# EAGLE design sensornode (EAGLE 7.7.0)
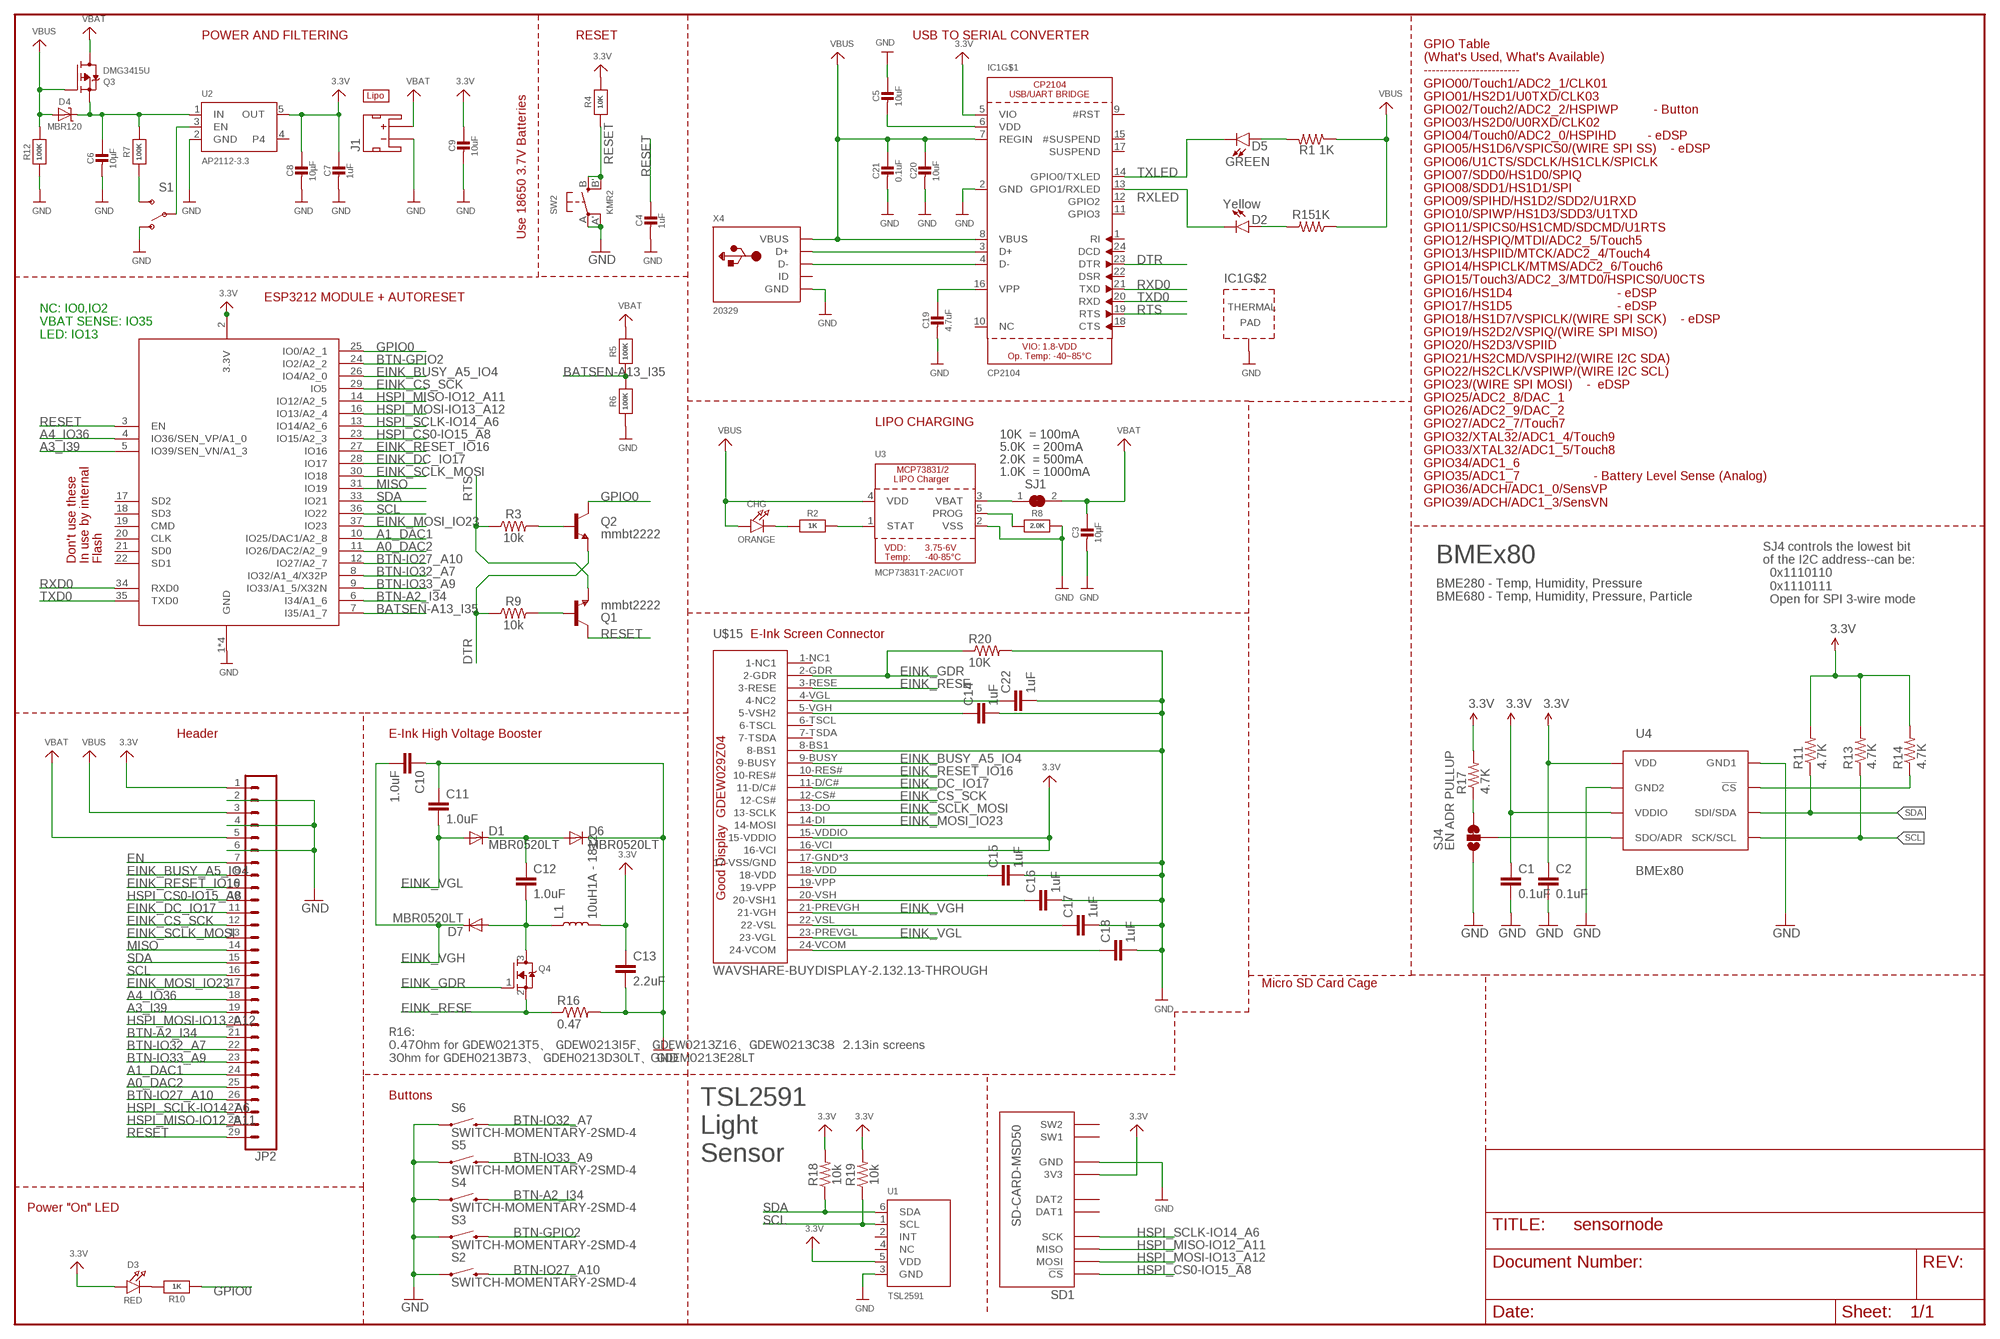
[diagram p0: schematic, sheet 1]

## Parts
BT1  LIPO-OUTLINE2000  [LIPO-2000]
C1  0.1uF  0.1UF-25V-5%(0603)  [0603-CAP]
C2  0.1uF  0.1UF-25V-5%(0603)  [0603-CAP]
C3  10µF  CAP_CERAMIC0805-NOOUTLINE  [0805-NO]
C4  1uF  CAP_CERAMIC0603_NO  [0603-NO]
C5  10uF  CAP_CERAMIC0805-NOOUTLINE  [0805-NO]
C6  10µF  CAP_CERAMIC0805-NOOUTLINE  [0805-NO]
C7  1uF  CAP_CERAMIC0603_NO  [0603-NO]
C8  10µF  CAP_CERAMIC0805-NOOUTLINE  [0805-NO]
C9  10uF  CAP_CERAMIC0805-NOOUTLINE  [0805-NO]
C10  1.0uF  1.0UF-0603-16V-10%  [0603]
C11  1.0uF  1.0UF-0603-16V-10%  [0603]
C12  1.0uF  1.0UF-0603-16V-10%  [0603]
C13  2.2uF  2.2UF-0603-10V-20%  [0603]
C14  1uF  0.1UF-25V-5%(0603)  [0603-CAP]
C15  1uF  0.1UF-25V-5%(0603)  [0603-CAP]
C16  1uF  0.1UF-25V-5%(0603)  [0603-CAP]
C17  1uF  0.1UF-25V-5%(0603)  [0603-CAP]
C18  1uF  0.1UF-25V-5%(0603)  [0603-CAP]
C19  4.7uF  CAP_CERAMIC0805-NOOUTLINE  [0805-NO]
C20  10uF  CAP_CERAMIC0805-NOOUTLINE  [0805-NO]
C21  0.1uF  CAP_CERAMIC0805-NOOUTLINE  [0805-NO]
C22  1uF  0.1UF-25V-5%(0603)  [0603-CAP]
CHG  ORANGE  LED0805_NOOUTLINE  [CHIPLED_0805_NOOUTLINE]
D1  MBR0520LT  [SOD123]
D2  Yellow  LED-YELLOW0603  [LED-0603]
D3  RED  LED0805_NOOUTLINE  [CHIPLED_0805_NOOUTLINE]
D4  MBR120  DIODE-SCHOTTKYSOD-123  [SOD-123]
D5  GREEN  LED-GREEN0603  [LED-0603]
D6  MBR0520LT  [SOD123]
D7  MBR0520LT  [SOD123]
IC1  CP2104  [QFN24_4MM_SMSC]
J1  JST_2MM_MALE  [JST-2-SMD]
JP2  CONN_29  [1X29]
L1  10uH1A - 1812  INDUCTOR  [1815]
Q1  mmbt2222  TRANSISTOR_NPNSOT23-3  [SOT23-3]
Q2  mmbt2222  TRANSISTOR_NPNSOT23-3  [SOT23-3]
Q3  DMG3415U  MOSFET-P  [SOT23-R]
Q4  MOSFET-NREFLOW  [SOT23]
R1  1K  1KOHM-1/10W-1%(0603)  [0603-RES]
R2  1K  RESISTOR_0603_NOOUT  [0603-NO]
R3  10k  10KOHM-0603-1/10W-1%  [0603]
R4  10K  RESISTOR_0603_NOOUT  [0603-NO]
R5  100K  RESISTOR_0603_NOOUT  [0603-NO]
R6  100K  RESISTOR_0603_NOOUT  [0603-NO]
R7  100K  RESISTOR_0603_NOOUT  [0603-NO]
R8  2.0K  RESISTOR_0603_NOOUT  [0603-NO]
R9  10k  10KOHM-0603-1/10W-1%  [0603]
R10  1K  RESISTOR_0603_NOOUT  [0603-NO]
R11  4.7K  4.7KOHM-1/10W-1%(0603)  [0603-RES]
R12  100K  RESISTOR_0603_NOOUT  [0603-NO]
R13  4.7K  4.7KOHM-1/10W-1%(0603)  [0603-RES]
R14  4.7K  4.7KOHM-1/10W-1%(0603)  [0603-RES]
R15  1K  1KOHM-1/10W-1%(0603)  [0603-RES]
R16  0.47  4.7KOHM-1/10W-1%(0603)  [0603-RES]
R17  4.7K  4.7KOHM-1/10W-1%(0603)  [0603-RES]
R18  10k  10KOHM-0603-1/10W-1%  [0603]
R19  10k  10KOHM-0603-1/10W-1%  [0603]
R20  10K  4.7KOHM-1/10W-1%(0603)  [0603-RES]
S1  SWITCH-SPDT-SMD-A  [SWITCH-SPST-SMD-A]
S2  SWITCH-MOMENTARY-2SMD-4  [TACTILE_SWITCH_TALL]
S3  SWITCH-MOMENTARY-2SMD-4  [TACTILE_SWITCH_TALL]
S4  SWITCH-MOMENTARY-2SMD-4  [TACTILE_SWITCH_TALL]
S5  SWITCH-MOMENTARY-2SMD-4  [TACTILE_SWITCH_TALL]
S6  SWITCH-MOMENTARY-2SMD-4  [TACTILE_SWITCH_TALL]
SD1  SD-CARD-MSD50  [SD_5031821853]
SJ1  SOLDERJUMPER_CLOSED  [SOLDERJUMPER_CLOSEDWIRE@1]
SJ4  EN ADR PULLUP  JUMPER-PAD-3-2OF3_NC_BY_TRACE_SMALL  [PAD-JUMPER-3-2OF3_NC_BY_TRACE_YES_SILK_FULL_BOX]
SW2  KMR2  SWITCH_TACT_SMT4.6X2.8  [BTN_KMR2_4.6X2.8]
U1  TSL2591  LIGHT_TSL2591  [DFN6_TAOS]
U2  AP2112-3.3  VREG_SOT23-5  [SOT23-5]
U3  MCP73831T-2ACI/OT  MCP73831/2  [SOT23-5]
U4  BMEx80  BME280  [BME280_LGA]
U$15  WAVSHARE-BUYDISPLAY-2.132.13-THROUGH  [WAVSHARE-BUYDISPLAY-2.13-THM]
X2  ESP32_WROOM32_SKINNY  [WROOM32_SKINNY]
X4  20329  MICRO-USB-SMD-B-(10118193-0001LF)-ADASYM  [MICRO-USB5+6P-SMD-0.65-B]

## Nets
3.3V: C1.1 C2.1 C7.1 C8.1 C9.1 C13.1 D3.A IC1.5(VIO) JP2.1 L1.2 R1.1 R4.2 R11.2 R13.2 R14.2 R15.1 R17.2 R18.2 R19.2 SD1.VCC(3V3) U1.5(VDD) U2.5(OUT) U4.P$6(VDDIO) U4.P$8(VDD) U$15.15-VDDIO U$15.16-VCI X2.2(3.3V) ; supply symbol labelled VBUS
!CS: R14.1 U4.P$2(!CS)
A0_DAC2: JP2.25 X2.11(IO26/DAC2/A2_9)
A1_DAC1: JP2.24 X2.10(IO25/DAC1/A2_8)
A3_I39: JP2.19 X2.5(IO39/SEN_VN/A1_3)
A4_IO36: JP2.18 X2.4(IO36/SEN_VP/A1_0)
BATSEN-A13_I35: R5.1 R6.2 X2.7(I35/A1_7)
BTN-A2_I34: JP2.21 S4.B2 X2.6(I34/A1_6)
BTN-GPIO2: S3.B2 X2.24(IO2/A2_2)
BTN-IO27_A10: JP2.26 S2.B2 X2.12(IO27/A2_7)
BTN-IO32_A7: JP2.22 S6.B2 X2.8(IO32/A1_4/X32P)
BTN-IO33_A9: JP2.23 S5.B2 X2.9(IO33/A1_5/X32N)
DTR: IC1.23(DTR) Q2.2(E) R9.1
EINK_BUSY_A5_IO4: JP2.8 U$15.9-BUSY X2.26(IO4/A2_0)
EINK_CS_SCK: JP2.12 U$15.12-CS# X2.29(IO5)
EINK_DC_IO17: JP2.11 U$15.11-D/C# X2.28(IO17)
EINK_GDR: Q4.1(G) R20.1 U$15.2-GDR
EINK_MOSI_IO23: JP2.17 U$15.14-DI(14-MOSI) X2.37(IO23)
EINK_RESE: Q4.2(S) R16.1 U$15.3-RESE
EINK_RESET_IO16: JP2.9 U$15.10-RES# X2.27(IO16)
EINK_SCLK_MOSI: JP2.13 U$15.13-DO(13-SCLK) X2.30(IO18)
EINK_VGH: C10.2 D7.C U$15.21-PREVGH(21-VGH)
EINK_VGL: C11.2 D1.A U$15.23-PREVGL(23-VGL)
EN: JP2.7 S1.2(P) U2.3(EN)
GND: C1.2 C2.2 C3.2 C4.2 C5.1 C6.2 C7.2 C8.2 C9.2 C10.1 C11.1 C13.2 C14.2 C15.2 C16.2 C17.2 C18.2 C19.2 C20.2 C21.2 C22.2 D6.C IC1.2(GND) IC1.THERM(TP) J1.1(-) JP2.2 JP2.4 JP2.6 R6.1 R8.2 R12.1 R16.2 R20.2 S1.1(O) S2.A2 S3.A2 S4.A2 S5.A2 S6.A2 SD1.GND SJ4.1 SW2.A'(P1) SW2.A(P) U1.3(GND) U2.2(GND) U3.2(VSS) U4.P$1(GND1) U4.P$7(GND2) U$15.8-BS1 U$15.17-GND(17-VSS/GND) U$15.25(17-VSS/GND) U$15.26(17-VSS/GND) X2.1(GND) X2.15(GND) X2.38(GND) X2.P$1(GND) X4.5(GND) X4.S1(GND) X4.S2(GND) X4.S3(GND) X4.S4(GND) X4.S5(GND) X4.S6(GND)
GPIO0: Q2.3(C) R10.1 X2.25(IO0/A2_1)
HSPI_CS0-IO15_A8: JP2.10 SD1.CS(!CS) X2.23(IO15/A2_3)
HSPI_MISO-IO12_A11: JP2.28 SD1.MISO X2.14(IO12/A2_5)
HSPI_MOSI-IO13_A12: JP2.20 SD1.MOSI X2.16(IO13/A2_4)
HSPI_SCLK-IO14_A6: JP2.27 SD1.SCK X2.13(IO14/A2_6)
MISO: JP2.14 X2.31(IO19)
N$1: CHG.C R2.1
N$2: R8.1 U3.5(PROG)
N$3: R2.2 U3.1(STAT)
N$4: R7.1 S1.3(S)
N$5: D3.C R10.2
N$6: C5.2 IC1.6(VDD)
N$7: C6.1 D4.C Q3.2(S) R7.2 U2.1(IN)
N$8: D5.A R1.2
N$9: SJ1.1 U3.3(VBAT)
N$10: D2.A R15.2
N$11: C12.1 D1.C D6.A
N$12: Q1.1(B) R9.2
N$13: Q2.1(B) R3.2
N$14: C12.2 D7.A L1.1 Q4.3(D)
N$15: R17.1 SJ4.3
N$16: C15.1 U$15.18-VDD
N$17: C16.1 U$15.20-VSH(20-VSH1)
N$18: C17.1 U$15.22-VSL
N$19: C18.1 U$15.24-VCOM
N$20: C14.1 U$15.5-VGH(5-VSH2)
N$23: C19.1 IC1.16(VPP)
N$24: C22.1 U$15.4-VGL(4-NC2)
RESET: C4.1 JP2.29 Q1.3(C) R4.1 SW2.B'(S1) SW2.B(S) X2.3(EN)
RTS: IC1.19(RTS) Q1.2(E) R3.1
RXD0: IC1.21(TXD) X2.34(RXD0)
RXLED: D2.C IC1.13(GPIO1/RXLED)
SCL: JP2.16 R13.1 R19.1 U1.1(SCL) U4.P$4(SCK/SCL) X2.36(IO22)
SDA: JP2.15 R11.1 R18.1 U1.6(SDA) U4.P$3(SDI/SDA) X2.33(IO21)
SDO/ADR: SJ4.2 U4.P$5(SDO/ADR)
TXD0: IC1.20(RXD) X2.35(TXD0)
TXLED: D5.C IC1.14(GPIO0/TXLED)
USBD_N [USB1]: IC1.4(D-) X4.2(D-)
USBD_P [USB1]: IC1.3(D+) X4.3(D+)
VBAT: C3.1 J1.2(+) JP2.5 Q3.3(D) R5.2 SJ1.2
VBUS: C20.1 C21.1 CHG.A D4.A IC1.7(REGIN) IC1.8(VBUS) JP2.3 Q3.1(G) R12.2 U3.4(VDD) X4.1(VBUS)
Unconnected: IC1.1(RI) IC1.9(#RST) IC1.10(NC) IC1.11(GPIO3) IC1.12(GPIO2) IC1.15(#SUSPEND) IC1.17(SUSPEND) IC1.18(CTS) IC1.22(DSR) IC1.24(DCD) J1.NC1(PAD1) J1.NC2(PAD2) SD1.DAT1 SD1.DAT2 SD1.SW1 SD1.SW2 U1.2(INT) U1.4(NC) U2.4 U$15.1-NC1 U$15.6-TSCL U$15.7-TSDA U$15.19-VPP X2.17(SD2) X2.18(SD3) X2.19(CMD) X2.20(CLK) X2.21(SD0) X2.22(SD1) X4.4(ID)

## Notes on the sheet
- POWER AND FILTERING | RESET | USB TO SERIAL CONVERTER
- GPIO Table
  (What's Used, What's Available)
  ------------------------
  GPIO00/Touch1/ADC2_1/CLK01
  GPIO01/HS2D1/U0TXD/CLK03
  GPIO02/Touch2/ADC2_2/HSPIWP          - Button
  GPIO03/HS2D0/U0RXD/CLK02
  GPIO04/Touch0/ADC2_0/HSPIHD         - eDSP
  GPIO05/HS1D6/VSPICS0/(WIRE SPI SS)    - eDSP
  GPIO06/U1CTS/SDCLK/HS1CLK/SPICLK
  GPIO07/SDD0/HS1D0/SPIQ
  GPIO08/SDD1/HS1D1/SPI
  GPIO09/SPIHD/HS1D2/SDD2/U1RXD
  GPIO10/SPIWP/HS1D3/SDD3/U1TXD
  GPIO11/SPICS0/HS1CMD/SDCMD/U1RTS
  GPIO12/HSPIQ/MTDI/ADC2_5/Touch5
  GPIO13/HSPIID/MTCK/ADC2_4/Touch4
  GPIO14/HSPICLK/MTMS/ADC2_6/Touch6
  GPIO15/Touch3/ADC2_3/MTD0/HSPICS0/U0CTS
  GPIO16/HS1D4                              - eDSP
  GPIO17/HS1D5                              - eDSP
  GPIO18/HS1D7/VSPICLK/(WIRE SPI SCK)    - eDSP
  GPIO19/HS2D2/VSPIQ/(WIRE SPI MISO)
  GPIO20/HS2D3/VSPIID
  GPIO21/HS2CMD/VSPIH2/(WIRE I2C SDA)
  GPIO22/HS2CLK/VSPIWP/(WIRE I2C SCL)
  GPIO23/(WIRE SPI MOSI)    -  eDSP
  GPIO25/ADC2_8/DAC_1
  GPIO26/ADC2_9/DAC_2
  GPIO27/ADC2_7/Touch7
  GPIO32/XTAL32/ADC1_4/Touch9
  GPIO33/XTAL32/ADC1_5/Touch8
  GPIO34/ADC1_6
  GPIO35/ADC1_7                     - Battery Level Sense (Analog)
  GPIO36/ADCH/ADC1_0/SensVP
  GPIO39/ADCH/ADC1_3/SensVN
- Use 18650 3.7V Batteries
- ESP3212 MODULE + AUTORESET
- NC: IO0,IO2
  VBAT SENSE: IO35
  LED: IO13
- LIPO CHARGING
- 10K  = 100mA
- 5.0K  = 200mA
- 2.0K  = 500mA
- 1.0K  = 1000mA
- SJ4 controls the lowest bit
  of the I2C address--can be:
    0x1110110
    0x1110111
    Open for SPI 3-wire mode
- Don't use these
  In use by internal
  Flash
- BMEx80
- BME280 - Temp, Humidity, Pressure
  BME680 - Temp, Humidity, Pressure, Particle
- E-Ink Screen Connector
- Header | E-Ink High Voltage Booster
- Micro SD Card Cage
- R16:
  0.47Ohm for GDEW0213T5、 GDEW0213I5F、 GDEW0213Z16、GDEW0213C38  2.13in screens
  3Ohm for GDEH0213B73、 GDEH0213D30LT、 GDEM0213E28LT
- TSL2591
  Light
  Sensor
- Buttons
- Power "On" LED

## Library data of the parts
BT1 = SparkFun-Batteries:LIPO-OUTLINE: LiPo Battery Outlines Outlines for common LiPo batteries sold by SparkFun. (Note: no terminals or connection points, just the dimensions.) SparkFun Products Polymer Lithium Ion Battery - 110mAh <https://www.sparkfun.com/products/13853> (PRT-13853) Polymer Lithium Ion Battery - 1000mAh <https://www.sparkfun.com/products/13813> (PRT-13813) Polymer Lithium Ion Battery - 2000mAh <https://www.sparkfun.com/products/8483> (PRT-08483); PROD_ID: BATT-08764; SF_SKU: PRT-08483
C1 C2 = SparkFun-Capacitors:0.1UF-25V-5%(0603): CAP-08604; PROD_ID: CAP-08604
C3-C9 C19-C21 = microbuilder:CAP_CERAMIC: Ceramic Capacitors For new designs, use the packages preceded by an '_' character since they are more reliable: The following footprints should be used on most boards: _0402 - Standard footprint for regular board layouts _0603 - Standard footprint for regular board layouts _0805 - Standard footprint for regular board layouts _1206 - Standard footprint for regular board layouts For extremely tight-pitch boards where space is at a premium, the following 'micro-pitch' footprints can be used (smaller pads, no silkscreen outline, etc.): _0402MP - Micro-pitch footprint for very dense/compact boards _0603MP - Micro-pitch footprint for very dense/compact boards _0805MP - Micro-pitch footprint for very dense/compact boards _1206MP - Micro-pitch footprint for very dense/compact boards
C10-C12 = SparkFun-Capacitors:1.0UF: 1µF ceramic capacitors A capacitor is a passive two-terminal electrical component used to store electrical energy temporarily in an electric field.; PROD_ID: CAP-00868
C13 = SparkFun-Capacitors:2.2UF: 2.2µF ceramic capacitors A capacitor is a passive two-terminal electrical component used to store electrical energy temporarily in an electric field.; PROD_ID: CAP-07888
C14-C18 C22 = SparkFun-Capacitors:0.1UF-25V-5%(0603): CAP-08604; PROD_ID: CAP-08604; VALUE: 0.1uF
CHG D3 = microbuilder:LED: LED 0603 - 0603 Surface Mount Package 2mA: Green LED - Low Power (3.9mcd, 2ma, 1.7Vf) - Digikey: 475-2709-2-ND Orange LED - Low Power (9.8mcd, 2ma, 1.8Vf) - Digikey: 475-1194-2-ND Red LED - Low Power (5mcd, 2ma, 1.8Vf) - Digikey: 475-1195-2-ND Yellow LED - Low Power (7mcd, 2ma, 1.8Vf) - Digikey: 475-1196-2-ND 5mA: Blue LED - Low Power (17mcd, 5ma, 2.9Vf) - Digikey: LNJ937W8CRACT-ND 0805 - 0805 Surface Mount Package 2mA: Red LED (8.8mcd, 2mA, 1.8Vf, Clear) - Low Power [Digikey: 475-2510-1-ND] Green LED (5mcd, 2mA, 1.8Vf, Clear) - Low Power [Digikey: 475-2730-1-ND] Yellow LED (11.3mcd, 2mA, 1.8Vf, Clear) - Low Power [Digikey: 475-2555-1-ND] 20mA: Red LED (104mcd, 20mA, Diffused) - LS R976 [Digikey: 475-1278-6-ND] Red LED (12mcd, 20mA, 2.0Vf, Clear) - APT2012EC [Digikey: 754-1128-1-ND] Green LED (15mcd, 20mA, 2.2Vf, Clear) - APT2012GC [Digikey: 754-1131-1-ND] Orange LED (160mcd, 20mA, 2.1Vf, Clear) - APT2012SECK [Digikey: 754-1130-1-ND] 1206 - 1206 Surface Mount Package Green LED (26mcd, 20mA, Diffused) - LG N971 [Digikey: 475-1407-6-ND] Red LED (15mcd, 20mA, Diffused) - LH N974 [Digikey: 475-1416-6-ND] Cree - Cree High-Power Surface Mount LEDs XPEBWT-L1-0000-00D50 - White 111lm 350mA 2.9Vf 6200K 110° XTEAWT-00-0000-00000LEE3 - White 114lm 350mA 2.85Vf 5000K 115° Everlight - Everlight 45-21 Series Surface Mount LEDs 45-21/QK2C-B2832AC2CB2/2T - Warm White 2000mcd 20mA 3.25Vf 3050K 120° 45-21/LK2C-B38452C4CB2/2T - Nuetral White 2000mcd 20mA 3.25Vf 4150K 120° 45-21/LK2C-B50634C6CB2/2T - Cold White 2200mcd 20mA 3.25Vf 5650K 120° PLCC2 Reverse Mount LS T77K-J1L2-1-0-2-R18-Z - Red 11.25mcd 2mA 1.8Vf 630nm 120° LO T77K-L1M2-24-Z - Orange 19.6mcd 2mA 1.8Vf 606nm 120° LY T77K-K2M1-26-Z - Yellow 15.7mcd 2mA 1.8Vf 587nm 120°
D1 D6 D7 = diode:MBR0520LT: SCHOTTKY BARRIER RECTIFIER Source: http://onsemi.com .. MBR0520LT1-D.pdf
D2 = SparkFun-LED:LED-YELLOW: Yellow SMD LEDs LilyPad 1206- DIO-09909 0603- DIO-09003 "SMART" means more efficient and expensive; PROD_ID: DIO-09003
D4 = microbuilder:DIODE-SCHOTTKY
D5 = SparkFun-LED:LED-GREEN: Various green LEDs Green LEDs used in SFE Production 0603- DIO-00821 LARGE- DIO-00862 LILYPAD- DIO-09910; PROD_ID: DIO-00821
IC1 = microbuilder:CP2104: CP2104 - USB to UART Bridge VDD Output: 3.45V
J1 = SparkFun-Connectors:JST_2MM_MALE: JST 2MM MALE RA CONNECTOR Two pin, compact surface mount connector. Commonly used as a battery input connection point. We really like the solid locking feeling and high current rating on these small connectors. We use these all the time as battery connectors. Mates to single-cell LiPo batteries. Here is the connector we sell at SparkFun: JST Right Angle Connector - White <https://www.sparkfun.com/products/8612> (PRT-08612) Datasheet <http://www.sparkfun.com/datasheets/Prototyping/Connectors/JST-Horizontal.pdf> It was used on these SparkFun products: SparkFun MOSFET Power Controller <https://www.sparkfun.com/products/11214> (PRT-11214) SparkFun Battery Babysitter - LiPo Battery Manager <https://www.sparkfun.com/products/13777> (PRT-13777) And many, many others that required a lipo battery connection.; PROD_ID: CONN-11443; SF_ID: PRT-08612
JP2 = SparkFun-Connectors:CONN_29: Multi connection point. Often used as Generic Header-pin footprint for 0.1 inch spaced/style header connections On any of the 0.1 inch spaced packages, you can populate with these: Break Away Headers - Straight <https://www.sparkfun.com/products/116> (PRT-00116) Break Away Male Headers - Right Angle <https://www.sparkfun.com/products/553> (PRT-00553) Female Headers <https://www.sparkfun.com/products/115> (PRT-00115) Break Away Headers - Machine Pin <https://www.sparkfun.com/products/117> (PRT-00117) Break Away Female Headers - Swiss Machine Pin <https://www.sparkfun.com/products/743> (PRT-00743) For SCREWTERMINALS and SPRING TERMINALS visit here: Screw Terimnals on SparkFun.com <https://www.sparkfun.com/search/results?term=Screw+Terminals> (5mm/3.5mm/2.54mm spacing) This device is also useful as a general connection point to wire up your design to another part of your project. Our various solder wires solder well into these plated through hole pads. Hook-Up Wire - Assortment (Stranded, 22 AWG) <https://www.sparkfun.com/products/11375> (PRT-11375) Hook-Up Wire - Assortment (Solid Core, 22 AWG) <https://www.sparkfun.com/products/11367> (PRT-11367) View the entire wire category on our website here <https://www.sparkfun.com/categories/141> Special notes: Molex polarized connector foot print use with SKU : PRT-08231 with associated crimp pins and housings. 1MM SMD Version SKU: PRT-10208 NOTES ON THE VARIANTS LOCK and LOCK_LONGPADS... This footprint was designed to help hold the alignment of a through-hole component (i.e. 6-pin header) while soldering it into place. You may notice that each hole has been shifted either up or down by 0.005 of an inch from it's more standard position (which is a perfectly straight line). This slight alteration caused the pins (the squares in the middle) to touch the edges of the holes. Because they are alternating, it causes a "brace" to hold the component in place. 0.005 has proven to be the perfect amount of "off-center" position when using our standard breakaway headers. Although looks a little odd when you look at the bare footprint, once you have a header in there, the alteration is very hard to notice. Also,if you push a header all the way into place, it is covered up entirely on the bottom side.
L1 = John - Inductors:INDUCTOR: Inductors Resist changes in electrical current. Basically a coil of wire. SparkFun Products: SparkFun Load Cell Amplifier - HX711 <https://www.sparkfun.com/products/13879> IOIO-OTG - V2.2 <https://www.sparkfun.com/products/13613>
Q1 Q2 = SparkFun:TRANSISTOR_NPN: Transistor NPN BJT configuration in SOT23 package. MMBT2222 is the common NPN we use. Double check BCE configuration again layout.
Q3 = microbuilder:MOSFET-P: P-Channel Mosfet LEGEND VDS: Voltage Drain-Source ID: Drain Current RDS(ON): Drain-Source On-State Resistance VGS(TH): Gate-Source Threshold Voltage CISS: Drain-Source Input Capacitance SOT-23 Name VDS ID RDS(ON) VGS(TH) CISS Order Number IRLML5103 30V 760mA 600 mOhm -- 75pF @ 25V Digikey: IRLML5103PBFCT-ND IRLML6401 12V 4.3A 50 mOhm 950mV @ 250µA 830pF @ 10V Digikey: IRLML6401PBFTR-ND NTR0202PL 20V 400mA 800 mOhm 2.3V @ 250uA 70pF @ 5V Digikey: NTR0202PLT1GOSTR-ND NTR4101PT1G 20V 1.8A 85 mOhm 1.2V @ 250uA 675pF @ 10V Digikey: NTR4101PT1GOSCT-ND DMP2004K 20V 600mA 900 mOhm 1V @ 250uA 175pF @ 16V Digikey: DMP2004KDICT-ND PMV65XP 20V 3.9A 76 mOhm 950mV @ 1mA 725pF @ 20V Digikey: 568-2358-2-ND TO-252 Name VDS ID RDS(ON) VGS(TH) CISS Order Number AOD417 30V 25A 34 mOhm 3V @ 250µA 920pF @ 15V Digikey: 785-1106-2-ND PowerPak Name VDS ID RDS(ON) VGS(TH) CISS Order Number AON7401 30V 12A 14 mOhm 3V @ 250µA 2600pF @ 15V Digikey: 785-1302-1-ND
Q4 = adafruit:MOSFET-N: N-Channel Mosfet 2N7002E - 60V 260mA SOT23 [Digikey: 2N7002ET1GOSTR-ND] - REEL BSH103 - 30V 850mA SOT23 [Digikey: 568-5013-1-ND]
R1 R15 = SparkFun-Resistors:1KOHM-1/10W-1%(0603): RES-07856; PROD_ID: RES-07856
R2 R4-R8 R10 R12 = microbuilder:RESISTOR: Resistors For new designs, use the packages preceded by an '_' character since they are more reliable: The following footprints should be used on most boards: _0402 - Standard footprint for regular board layouts _0603 - Standard footprint for regular board layouts _0805 - Standard footprint for regular board layouts _1206 - Standard footprint for regular board layouts For extremely tight-pitch boards where space is at a premium, the following 'micro-pitch' footprints can be used (smaller pads, no silkscreen outline, etc.): _0402MP - Micro-pitch footprint for very dense/compact boards _0603MP - Micro-pitch footprint for very dense/compact boards _0805MP - Micro-pitch footprint for very dense/compact boards _1206MP - Micro-pitch footprint for very dense/compact boards
R3 R9 R18 R19 = SparkFun-Resistors:10KOHM: 10kΩ resistor A resistor is a passive two-terminal electrical component that implements electrical resistance as a circuit element. Resistors act to reduce current flow, and, at the same time, act to lower voltage levels within circuits. - Wikipedia; PROD_ID: RES-00824
R11 R13 R14 R17 = SparkFun-Resistors:4.7KOHM-1/10W-1%(0603): RES-07857; PROD_ID: RES-07857
R16 R20 = SparkFun-Resistors:4.7KOHM-1/10W-1%(0603): RES-07857; PROD_ID: RES-07857; VALUE: 4.7K
S1 = SparkFun-Electromechanical:SWITCH-SPDT: SPDT Switch Simple slide switch, Spark Fun Electronics SKU : COM-00102 DPDT SMT slide switch, AYZ0202, SWCH-08179; PROD_ID: SWCH-10651
S2-S6 = SparkFun-Electromechanical:SWITCH-MOMENTARY-2: Various NO switches- pushbuttons, reed, etc; PROD_ID: SWCH-11966
SD1 = we-con:SD-CARD: SD-Card Socket; DIGIKEY: WM9750TR-ND
SJ1 = microbuilder:SOLDERJUMPER_CLOSED: Solder Jumper - Closed These solder jumpers are closed by default CLOSEDWIRE - 10 mil trace between pads that can be cut and resoldered later CLOSEDPERM - 63 mil trace between pads for a permanent connection (used to 'bridge' two signals, a shameless hack for Eagle). Can double as a test point as well (no cream layer)
SJ4 = SparkFun-Passives:JUMPER-PAD-3-2OF3_NC_BY_TRACE
SW2 = microbuilder:SWITCH_TACT_SMT: SMT Tact Switches 6x6mm - Digikey: P12940SCT-ND KMR2 (4.6x2.8mm) - Digikey: 401-1426-1-ND EVQ-PQHB55 - Light Touch, 160GF (4.5x4.5mm) - Digikey: P8090SCT-ND KMT0 - KMT021 NGJ LHS (etc.) IP68/Waterproof - Digikey: CKN10289CT-ND
U1 = microbuilder:LIGHT_TSL2591: TSL2591 Light-To-Digital Sensor
U2 = microbuilder:VREG_SOT23-5: SOT23-5 Fixed Voltage Regulators Part Current Out V Out V In V Dropout θJA (°C/W) TJ (°C) Digikey Part No. ADP121 150mA 3.3V 3.4-5.5V 0.09V @ 150mA -- -- ADP121-AUJZ33R7CT-ND ADP121 150mA 3.0V 3.1-5.5V 0.09V @ 150mA -- -- ADP121-AUJZ30R7CT-ND ADP122 300mA 3.3V 3.4-5.5V 0.085V @ 300mA -- -- ADP122AUJZ-3.3-R7CT-ND ADP1712 300mA 3.3V 3.5-5.5V 0.17V @ 300mA -- -- ADP1712AUJZ-3.3-R7TR-ND AP7311 (Low Cost) 150mA 3.3V 3.5-6V 0.15V @ 150mA -- -- AP7311-33WG-7DICT-ND LD39015M18R 150mA 1.8V 1.9V-5.5V 0.08V @ 100mA -- -- 497-6977-1-ND LP2985A-33DBVR 150mA 3.3V 3.3-16V 0.28V @ 150mA 206 150 296-18479-1-ND MCP1824T-3302E/OT 300mA 3.3V 3.5V-6V 0.2V @ 300mA -- -- MCP1824T-3302E/OTCT-ND MIC5205-2.5YM5 TR 150mA 2.5V 2.7-16V 0.165V @ 150mA -- -- 576-1257-2-ND MIC5205-3.0YM5 TR 150mA 3.0V 3.2V-16V 0.165V @ 150mA -- -- 576-1258-2-ND MIC5205-3.3YM5 TR 150mA 3.3V 3.5V-16V 0.165V @ 150mA -- -- 576-1259-2-ND TPS780330220 150mA 3.3V+2.2V 3.6-5.5V 250mV Max -- -- 296-23332-1-ND TDA3663/N1,135 100mA 3.3V 3.5-45V 0.18V @ 50mA -- -- 568-5343-1-ND Max operating temp can be calculated using θJA, TJ (max junction temperature), and power in watts. Set the "Maximum Ambient Temperature" until it reaches TJ ("Max Junction Temperature"), which is the absolute limit for safe use of the regulator: Heat Sink Temperature Calculator <http://www.daycounter.com/Calculators/Heat-Sink-Temperature-Calculator.phtml> For example, With 12V source into a 3.3V LP2985 and a 30mA load, we are dissipating (12V-3.3V) * 0.03A = 0.261W. With a θJA of 206 °C/W, a TJ of 150°C, and 261mW we can safely use the chip without a heat sink up to 75°C (=147.1°C Junction Temperature).
U3 = microbuilder:MCP73831/2: MCP73831/2 LIPO Charger VDD: 3.75 - 6V Temp -40 - 85°C Programmable Charge Rate: 15-500mA NOTE: STAT is a tri-state logic output on the MCP73831 and an open-drain output on the MCP73832. SOT23-5 with 4.2V output and tri-state logic on STAT = MCP73831T-2ACI/OT
U4 = BME280ComponentLibrary:BME280; PROD_ID: IC-13090; VALUE: BME280
U$15 = Warthog9-Screens:WAVSHARE-BUYDISPLAY-2.13: 2.13in EPD based on Wavshare or Buydisplay, copied from the ESP_trINKet project's setup
X2 = microbuilder:ESP32_WROOM32
X4 = microbuilder:MICRO-USB-SMD-B-(10118193-0001LF)-ADASYM

## Net classes
1 USB1: width 0.305 mm

## Board
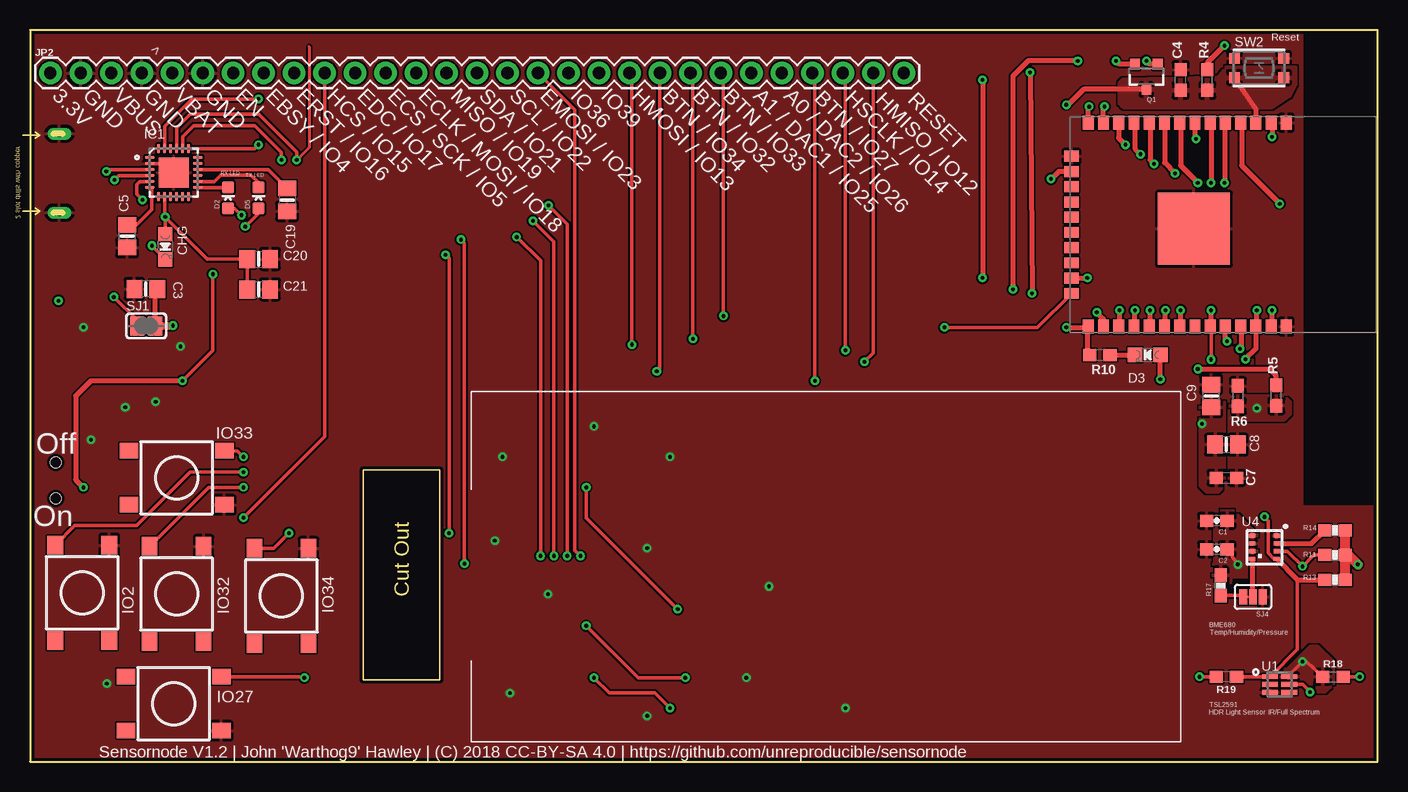
[diagram p1: board, top side]
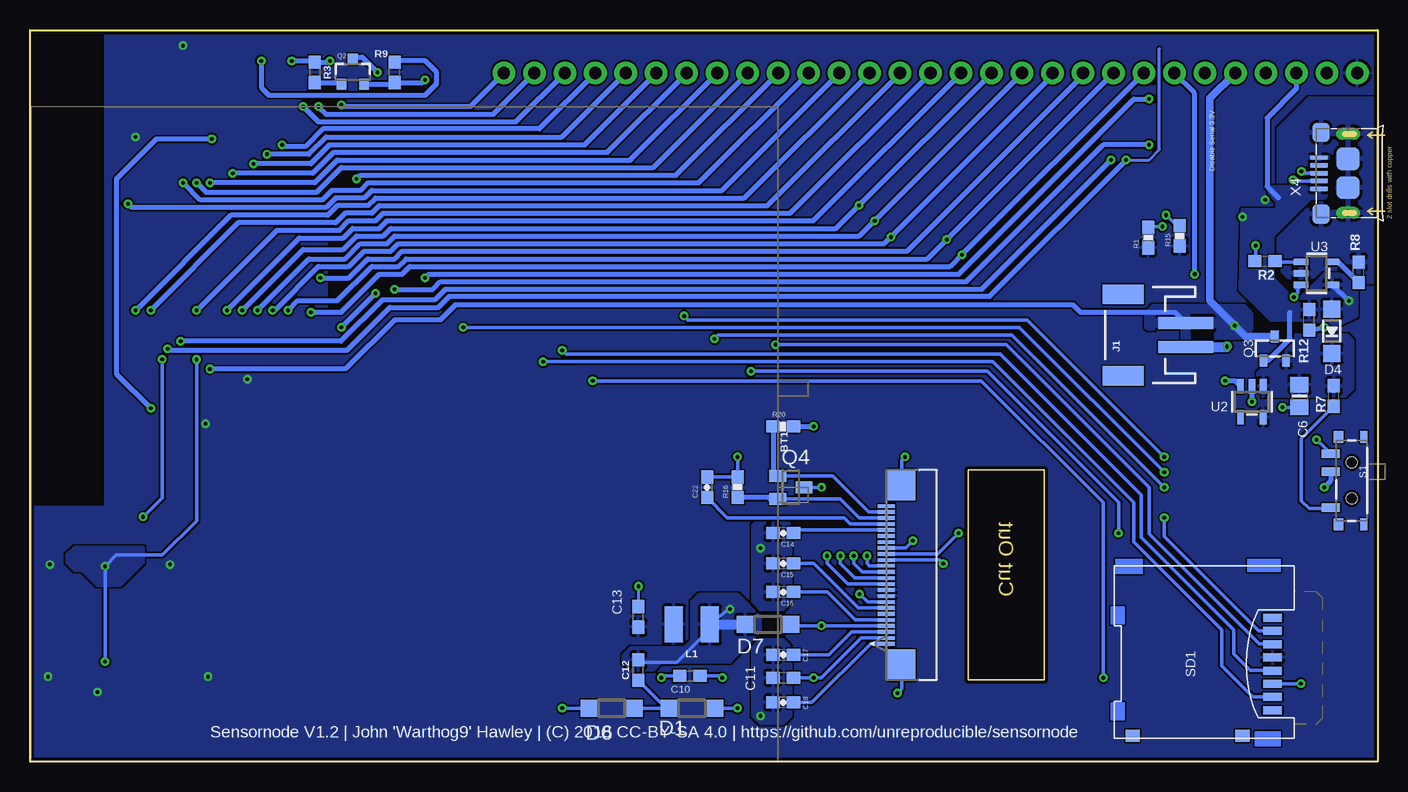
[diagram p2: board, bottom side, seen from below]

Size 112.3 x 61 mm. Coordinates in mm from the lower left corner, seen from the top.
Outline: 112.3,0 112.3,61 0,61 0,0 112.3,0
Copper layers (1*16): Top 0.035mm / dielectric 1.5mm / Bottom 0.035mm
Design rules "default *": minimum track width 6mil, minimum drill 12mil, track to track 6mil, track to pad 6mil, pad to pad 6mil, via to via 6mil, smd to smd 6mil, copper to edge 10mil, drill to drill 8mil, minimum pad ring 10mil, minimum via ring 8mil, stop-mask expansion 4mil, vias tented up to drill 0mil, thermal gap 10mil

### Footprints (pad centres in the part's own frame; a part is rotated, then mirrored left to right if it is on the bottom)
0603-CAP = smd 1.1 x 1: 1 -0.85,0; 2 0.85,0
0805-NO = smd 1.3 x 1.5: 1 -0.95,0; 2 0.95,0
0603-NO = smd 1.1 x 1: 1 -0.85,0; 2 0.85,0
0603 = smd 1.1 x 1: 1 -0.85,0; 2 0.85,0
CHIPLED_0805_NOOUTLINE = smd 1.2 x 1.2: A 0,-1.05; C 0,1.05
SOD123 = smd 1.4 x 1.4: A 1.9,0; C -1.9,0
LED-0603 = smd 1 x 1: A 0,-0.877; C 0,0.877
SOD-123 = smd 1.4 x 1.4: A 1.85,0; C -1.85,0
QFN24_4MM_SMSC = smd 0.8 x 0.28: 1 -2,1.25; 2 -2,0.75; 3 -2,0.25; 4 -2,-0.25; 5 -2,-0.75; 6 -2,-1.25; 13 2,-1.25; 14 2,-0.75; 15 2,-0.25; 16 2,0.25; 17 2,0.75; 18 2,1.25 | smd 0.28 x 0.8: 7 -1.25,-2; 8 -0.75,-2; 9 -0.25,-2; 10 0.25,-2; 11 0.75,-2; 12 1.25,-2; 19 1.25,2; 20 0.75,2; 21 0.25,2; 22 -0.25,2; 23 -0.75,2; 24 -1.25,2 | smd 2.5 x 2.5: THERM 0,0
JST-2-SMD = smd 1 x 4.6: 1 -1,-3.7; 2 1,-3.7 | smd 1.6 x 3.4: NC1 -3.4,1.5; NC2 3.4,1.5
1X29 = drill 1.016 pad 1.88: 1 0,0; 2 2.54,0; 3 5.08,0; 4 7.62,0; 5 10.16,0; 6 12.7,0; 7 15.24,0; 8 17.78,0; 9 20.32,0; 10 22.86,0; 11 25.4,0; 12 27.94,0; 13 30.48,0; 14 33.02,0; 15 35.56,0; 16 38.1,0; 17 40.64,0; 18 43.18,0; 19 45.72,0; 20 48.26,0; 21 50.8,0; 22 53.34,0; 23 55.88,0; 24 58.42,0; 25 60.96,0; 26 63.5,0; 27 66.04,0; 28 68.58,0; 29 71.12,0
1815 = smd 1.5 x 3: 1 -1.5,0; 2 1.5,0
SOT23-3 = smd 0.8 x 0.9: 1 -0.95,-1; 2 0.95,-1; 3 0,1.1
SOT23-R = smd 0.635 x 1.016: 1 -0.95,-1; 2 0.95,-1; 3 0,1
SOT23 = smd 1 x 1.4: 1 -0.95,-1.1; 2 0.95,-1.1; 3 0,1.1
0603-RES = smd 1.1 x 1: 1 -0.85,0; 2 0.85,0
SWITCH-SPST-SMD-A = smd 0.7 x 1.5: 1 -2.25,-1.75; 2 -0.75,-1.75; 3 2.25,-1.75 | smd 1 x 0.6: GND1 -3.65,1; GND3 3.65,1 | smd 1 x 0.8: GND2 -3.65,-1.1; GND4 3.65,-1.1 | hole 0.9: -1.5,0; 1.5,0
TACTILE_SWITCH_TALL = smd 1.55 x 1.3: A1 -3.975,-2.25; A2 3.975,-2.25; B1 -3.975,2.25; B2 3.975,2.25
SD_5031821853 = smd 0.65 x 1.6: CS 2.75,0.8; DAT1 -3.85,0.8; DAT2 3.85,0.8; GND -1.65,0.8; MISO -2.75,0.8; MOSI 1.65,0.8; SCK -0.55,0.8; VCC 0.55,0.8 | smd 1 x 1.2: SW1 -6,12.45; SW2 -6,3.3
SOLDERJUMPER_CLOSEDWIRE@1 = smd 1.168 x 1.6: 1 -0.762,0; 2 0.762,0 | smd 0.635 x 0.203: WIRE 0,0
PAD-JUMPER-3-2OF3_NC_BY_TRACE_YES_SILK_FULL_BOX = smd 0.635 x 1.27: 1 -0.813,0; 2 0,0; 3 0.813,0
BTN_KMR2_4.6X2.8 = smd 0.9 x 0.9: A 2.05,0.8; A' -2.05,0.8; B 2.05,-0.8; B' -2.05,-0.8
DFN6_TAOS = smd 1.3 x 0.4: 1 -0.8,0.65; 2 -0.8,0; 3 -0.8,-0.65; 4 0.8,-0.65; 5 0.8,0; 6 0.8,0.65
SOT23-5 = smd 0.55 x 1.2: 1 -0.95,-1.3; 2 0,-1.3; 3 0.95,-1.3; 4 0.95,1.3; 5 -0.95,1.3
BME280_LGA = smd 0.5 x 0.35: P$1 1.025,0.975; P$2 1.025,0.325; P$3 1.025,-0.325; P$4 1.025,-0.975; P$5 -1.025,-0.975; P$6 -1.025,-0.325; P$7 -1.025,0.325; P$8 -1.025,0.975
WAVSHARE-BUYDISPLAY-2.13-THM = smd 1.397 x 0.305 bottom: 1-NC1 -4.267,1.245; 2-GDR -4.267,1.727; 3-RESE -4.267,2.235; 4-VGL -4.267,2.743; 5-VGH -4.267,3.226; 6-TSCL -4.267,3.734; 7-TSDA -4.267,4.242; 8-BS1 -4.267,4.724; 9-BUSY -4.267,5.232; 10-RES# -4.267,5.74; 11-D/C# -4.267,6.223; 12-CS# -4.267,6.731; 13-DO -4.267,7.239; 14-DI -4.267,7.747; 15-VDDIO -4.267,8.23; 16-VCI -4.267,8.738; 17-GND -4.267,9.246; 18-VDD -4.267,9.728; 19-VPP -4.267,10.236; 20-VSH -4.267,10.744; 21-PREVGH -4.267,11.227; 22-VSL -4.267,11.735; 23-PREVGL -4.267,12.243; 24-VCOM -4.267,12.725 | smd 2.311 x 2.642 bottom: 25 -2.997,-0.533; 26 -2.997,14.503
WROOM32_SKINNY = smd 1.2 x 0.9: 1 -8.5,5; 2 -8.5,3.73; 3 -8.5,2.46; 4 -8.5,1.19; 5 -8.5,-0.08; 6 -8.5,-1.35; 7 -8.5,-2.62; 8 -8.5,-3.89; 9 -8.5,-5.16; 10 -8.5,-6.43; 11 -8.5,-7.7; 12 -8.5,-8.97; 13 -8.5,-10.24; 14 -8.5,-11.51; 25 8.5,-11.51; 26 8.5,-10.24; 27 8.5,-8.97; 28 8.5,-7.7; 29 8.5,-6.43; 30 8.5,-5.16; 31 8.5,-3.89; 32 8.5,-2.62; 33 8.5,-1.35; 34 8.5,-0.08; 35 8.5,1.19; 36 8.5,2.46; 37 8.5,3.73; 38 8.5,5 | smd 0.9 x 1.2: 15 -5.7,-12.9; 16 -4.43,-12.9; 17 -3.16,-12.9; 18 -1.89,-12.9; 19 -0.62,-12.9; 20 0.65,-12.9; 21 1.92,-12.9; 22 3.19,-12.9; 23 4.46,-12.9; 24 5.73,-12.9 | smd 6 x 6: P$1 0.34,-2.7
MICRO-USB5+6P-SMD-0.65-B = smd 0.4 x 1.5: 1 -1.3,-0.25; 2 -0.65,-0.25; 3 0,-0.25; 4 0.65,-0.25; 5 1.3,-0.25 | smd 1.6 x 1.4: S1 -3.4,-0.427; S6 3.4,-0.427 | drill 0.508 pad 1.016 long: S2 -3.3,-2.675; S5 3.3,-2.675 | smd 1.9 x 1.9: S3 -1.2,-2.675; S4 1.2,-2.675

### Placement (x,y rotation side)
BT1  50.01,54.61 180 bottom
C1  98.9,20.08 180 top
C2  98.9,17.7 180 top
C3  9.65,39.4 180 top
C4  95.89,56.83 90 top
C5  8.1,43.81 90 top
C6  6.51,30.48 270 bottom
C7  99.7,23.66 0 top
C8  99.7,26.43 0 top
C9  98.42,30.48 90 top
C10  57.31,7.14 0 bottom
C11  49.53,6.99 0 bottom
C12  61.59,7.62 90 bottom
C13  61.59,12.06 90 bottom
C14  49.53,19.05 180 bottom
C15  49.53,16.51 180 bottom
C16  49.53,14.13 180 bottom
C17  49.53,8.89 180 bottom
C18  49.53,4.92 180 bottom
C19  21.43,46.83 270 top
C20  19.05,41.91 0 top
C21  19.05,39.37 0 top
C22  55.88,22.86 90 bottom
CHG  11.27,42.93 180 top
D1  57.15,4.45 0 bottom
D2  16.51,46.99 0 top
D3  93.14,33.91 90 top
D4  3.81,35.88 90 bottom
D5  19.05,46.99 0 top
D6  63.82,4.45 0 bottom
D7  50.8,11.43 180 bottom
IC1  11.96,49.12 0 top
J1  19.68,35.56 90 bottom
JP2  1.7,57.42 0 top
L1  57.15,11.43 180 bottom
Q1  93.03,57.15 180 top
Q2  85.41,57.47 0 bottom
Q3  8.57,34.45 0 bottom
Q4  48.9,22.86 270 bottom
R1  19.11,43.69 90 bottom
R2  9.4,41.72 0 bottom
R3  88.58,57.47 270 bottom
R4  98.11,56.83 90 top
R5  103.86,30.52 90 top
R6  100.65,30.48 270 top
R7  3.65,30.48 90 bottom
R8  1.59,40.8 90 bottom
R9  81.92,57.47 90 bottom
R10  89.16,33.91 0 top
R11  108.74,17.23 0 top
R12  5.71,36.83 90 bottom
R13  108.74,15.16 0 top
R14  108.74,19.29 0 top
R15  16.48,43.85 90 bottom
R16  53.34,22.86 90 bottom
R17  99.22,14.69 90 top
R18  108.58,7.07 0 top
R19  99.69,7.07 180 top
R20  49.53,27.94 0 bottom
S1  2.16,23.43 270 bottom
S2  11.97,4.82 0 top
S3  4.35,14.06 90 top
S4  20.95,13.81 90 top
S5  12.22,23.65 0 top
S6  12.22,13.97 90 top
SD1  7.96,8.13 90 bottom
SJ1  9.68,36.32 0 top
SJ4  101.92,13.73 180 top
SW2  102.42,57.83 0 top
U1  104.14,6.43 0 top
U2  10.48,30 180 bottom
U3  5.08,40.7 270 bottom
U4  102.87,17.86 0 top
U$15  36.67,22.54 180 top
X2  99.69,44.77 270 top
X4  5.13,49.05 90 bottom

### Tracks (layer width: path | path; a pad name or v marks a point on that pad's centre or on a via)
3.3V  (via drill 0.3)
  Top 0.305: 98.74,29.53 99.06,29.21 | 101.85,17.54 U4.P$6 | C2.1 v100.65,16.43 99.86,17.54 | R19.2 v97.47,7.07 | R18.2 v110.81,7.07 | U1.5 106.05,6.43 v106.68,5.79 | IC1.5 9.16,48.37 8.89,48.1 8.89,47.31 v9.37,46.83
  Top 0.406: X2.2 103.5,53.27 v103.5,52.07 | v94.19,31.86 D3.A | R4.2 98.11,58.26 v99.54,59.69
  Top 0.813: R13.2 R11.2 | R11.2 R14.2 | R11.2 109.86,17.23 v110.65,16.43
  other vias: 97.68,28.16
  pour Bottom (rank 6): 0,0 113.03,0 113.67,21.29 106.05,21.29 106.05,64.14 0,64.77
  pour Top: 98.74,20.4 98.74,16.59 98.58,16.43 98.58,15 98.9,14.69 99.69,14.53 100.01,14.84 100.09,15.4 101.44,15.4 101.44,17.23 102.08,17.23 102.23,17.38 102.23,17.7 101.44,17.7 101.28,18.02 101.28,18.34 101.44,18.65 102.23,18.65 102.23,18.97 100.33,20.88 99.22,20.88
  pour Top: 98.5,30.5 99,30.5 99.5,30 99.5,23 99,22.5 98,22.5 97.5,23 97.5,30 98,30.5
!CS
  Top 0.406: U4.P$2 106.79,18.18 R14.1
A0_DAC2  (via drill 0.3)
  Top 0.406: X2.11 92,53.27 92.08,53.34 92.08,51.12 v92.55,50.64
  Bottom 0.406: JP2.25 68,52.07 87.63,52.07 89.06,50.64 v92.55,50.64
A1_DAC1  (via drill 0.3)
  Top 0.406: X2.10 93.27,53.27 93.34,53.34 93.34,50.16 v93.66,49.85
  Bottom 0.406: JP2.24 66.04,51.49 66.04,51.44 87.31,51.44 88.9,49.85 v93.66,49.85
A3_I39  (via drill 0.3)
  Top 0.406: 99.69,53.34 99.62,53.27 X2.5 99.61,48.34 v99.54,48.26
  Bottom 0.406: JP2.19 56.57,48.26 84.14,48.26 84.77,47.62 87.15,47.62 87.95,46.83 98.11,46.83 v99.54,48.26
A4_IO36  (via drill 0.3)
  Top 0.406: X2.4 100.89,53.27 100.97,53.34 100.97,49.69 v104.14,46.51
  Bottom 0.406: JP2.18 54.67,47.62 83.82,47.62 84.45,46.99 86.84,46.99 87.63,46.2 103.82,46.2 v104.14,46.51
BATSEN-A13_I35  (via drill 0.3)
  Top 0.406: X2.7 97.08,51.99 v97.16,51.91
  Bottom 0.406: v102.23,29.46 105.09,32.32 105.09,48.58 101.76,51.91 v97.16,51.91
  pour Top: 100.5,30.5 104.5,30.5 105,30 105,29 104.5,28.5 100.5,28.5 100,29 100,30
BTN-A2_I34  (via drill 0.3)
  Top 0.305: JP2.21 52.49,32.81 v52.23,32.54 | v21.59,19.05 20.33,17.79 S4.B2
  Top 0.406: 98.42,53.34 98.35,53.27 X2.6 98.42,53.19 v98.42,48.26
  Bottom 0.305: v21.59,19.05 21.59,21.59 32.54,32.54 v52.23,32.54
  Bottom 0.406: JP2.21 60.38,49.53 86.36,49.53 88.42,47.47 97.63,47.47 v98.42,48.26
BTN-GPIO2  (via drill 0.3)
  Top 0.305: S3.B2 3.75,19.68 8.89,19.68 13.34,24.13 v17.78,24.13 | X2.24 83.95,36.2 v76.2,36.2
  Bottom 0.305: v76.2,36.2 29.84,36.2 v17.78,24.13
BTN-IO27_A10  (via drill 0.3)
  Top 0.305: JP2.26 65.41,57.21 v65.41,31.75 | v22.86,6.99 22.78,7.07 S2.B2
  Top 0.406: X2.12 90.72,51.99 v91.28,51.44
  Bottom 0.305: v22.86,6.99 22.86,21.59 33.02,31.75 v65.41,31.75
  Bottom 0.406: JP2.26 69.85,52.76 87.89,52.76 89.38,51.28 91.12,51.28 v91.28,51.44
BTN-IO32_A7  (via drill 0.3)
  Top 0.305: S6.B2 14.89,22.86 v17.78,22.86 | v55.24,35.24 55.24,57.21 JP2.22
  Top 0.406: X2.8 95.81,53.27 95.89,53.34 95.89,49.69 v97.31,48.26
  Bottom 0.305: v55.24,35.24 54.93,35.56 30.48,35.56 v17.78,22.86
  Bottom 0.406: JP2.22 62.23,50.22 62.23,50.16 86.68,50.16 88.58,48.26 v97.31,48.26
BTN-IO33_A9  (via drill 0.3)
  Top 0.305: 16.33,26.04 S5.B2 17.28,25.9 v17.78,25.4 | v57.78,37.15 57.78,57.21 JP2.23 | X2.9 94.54,53.27
  Top 0.406: 94.54,53.27 94.54,49.92 v95.41,49.05
  Bottom 0.305: v57.78,37.15 57.47,36.83 29.21,36.83 v17.78,25.4
  Bottom 0.406: JP2.23 64.19,50.8 87,50.8 88.74,49.05 v95.41,49.05
DTR  (via drill 0.3)
  Top 0.305: IC1.23 11.21,52.97 12.86,54.61 13.49,55.24 v19.05,55.24
  Top 0.406: v79.38,56.83 v79.38,40.32
  Bottom 0.406: Q2.2 82.06,56.47 R9.1 79.59,56.62 v79.38,56.83 | v79.38,40.32 79.06,40.64 34.92,40.64 20.95,54.61 20.32,55.24 v19.05,55.24
EINK_BUSY_A5_IO4  (via drill 0.3)
  Top 0.305: v34.92,19.05 34.92,41.97 v34.64,42.26
  Top 0.406: X2.26 89.45,36.91 v88.9,37.47
  Bottom 0.305: U$15.9-BUSY 36.66,17.31 v34.92,19.05
  Bottom 0.406: JP2.8 v34.64,42.26 35.62,41.27 80.64,41.27 81.28,40.64 83.19,40.64 86.36,37.47 v88.9,37.47
EINK_CS_SCK  (via drill 0.3)
  Top 0.305: 42.55,44.45 v41.91,45.09 43.66,43.34 v43.66,17.14
  Top 0.406: X2.29 93.34,36.35 v93.34,37.62
  Bottom 0.305: U$15.12-CS# 42.96,15.81 43.66,16.51 v43.66,17.14
  Bottom 0.406: JP2.12 29.64,57.36 v41.91,45.09 43.18,43.81 81.92,43.81 82.55,43.18 84.77,43.18 86.04,41.91 89.06,41.91 v93.34,37.62
EINK_DC_IO17  (via drill 0.3)
  Top 0.305: v42.55,17.14 42.55,41.75 v40.56,43.74
  Top 0.406: X2.28 92.08,36.35 v92.08,37.62
  Bottom 0.305: U$15.11-D/C# 42.35,16.32 42.55,16.51 v42.55,17.14
  Bottom 0.406: JP2.11 26.99,57.31 v40.56,43.74 41.12,43.18 81.6,43.18 82.23,42.55 84.45,42.55 85.72,41.27 88.27,41.27 91.92,37.62 v92.08,37.62
EINK_GDR
  Bottom 0.305: U$15.2-GDR 42.41,20.82 45.4,23.81 Q4.1
  Bottom 0.406: R20.1 50.38,24.2 Q4.1
EINK_MOSI_IO23  (via drill 0.3)
  Top 0.305: 45.09,54.67 JP2.17 45.4,54.35 45.4,17.62 v45.88,17.14
  Top 0.406: X2.37 103.5,36.35 v103.5,37.62
  Bottom 0.305: U$15.14-DI 44.16,14.8 45.88,16.51 v45.88,17.14
  Bottom 0.406: JP2.17 52.76,46.99 83.5,46.99 84.14,46.35 86.68,46.35 87.47,45.56 95.57,45.56 v103.5,37.62
EINK_RESE
  Bottom 0.305: U$15.3-RESE 40.95,20.32 43.18,20.32 44.77,21.91 Q4.2 50.31,21.59
  Bottom 0.406: 50.31,21.59 50.73,22.01 R16.1
EINK_RESET_IO16  (via drill 0.3)
  Top 0.305: v36.2,16.51 36.2,43.24 v35.91,43.53
  Top 0.406: X2.27 90.81,36.35 v90.81,37.62
  Bottom 0.305: U$15.10-RES# 36.49,16.8 v36.2,16.51
  Bottom 0.406: 21.91,57.31 JP2.9 v35.91,43.53 37.52,41.91 80.96,41.91 81.6,41.27 83.82,41.27 86.68,38.42 90.01,38.42 v90.81,37.62
EINK_SCLK_MOSI  (via drill 0.3)
  Top 0.305: 43.81,45.78 v43.21,46.38 44.77,44.82 v44.77,17.14
  Top 0.406: X2.30 94.61,36.35 v94.61,37.62
  Bottom 0.305: U$15.13-DO 43.56,15.3 44.77,16.51 v44.77,17.14
  Bottom 0.406: JP2.13 v43.21,46.38 45.14,44.45 82.23,44.45 82.87,43.81 85.09,43.81 86.2,42.7 89.53,42.7 v94.61,37.62
EINK_VGH  (via drill 0.3)
  Top 0.305: v54.61,6.99 50.69,6.99 v46.35,11.32
  Bottom 0.305: U$15.21-PREVGH v46.35,11.32 48.79,11.32 D7.C | C10.2 54.77,7.14 v54.61,6.99
EINK_VGL  (via drill 0.3)
  Top 0.305: v46.99,6.99 48.26,5.71 52.07,5.71 v53.34,4.45
  Bottom 0.305: U$15.23-PREVGL 43.04,10.3 46.35,6.99 v46.99,6.99 C11.2 | D1.A v53.34,4.45
EN  (via drill 0.3)
  Top 0.305: v15.24,40.64 15.24,34.29 v12.7,31.75
  Top 0.406: v12.7,31.75 5.08,31.75 3.81,30.48 3.81,23.5 v4.45,22.86
  Bottom 0.406: 16.83,57.31 JP2.7 15.24,55.72 v15.24,40.64 | S1.2 3.91,23.4 v4.45,22.86 | U2.3 11.87,31.75 v12.7,31.75
GND  (via drill 0.3)
  Top 0.305: IC1.2 11.21,49.87 IC1.THERM
  Top 0.406: C9.2
  Top 0.813: 97.18,44.61 X2.P$1
  Bottom 0.254: v61.59,14.61 C13.2
  Bottom 0.305: S1.1 4.45,26.22 v5.08,26.83 | C6.2 v7.94,29.53 | U$15.25 39.67,25.1 v39.37,25.4 | U$15.26 39.67,6.05 v40.01,5.71 | U$15.17-GND 42.51,13.3 v43.18,13.97 | C10.1 59.53,7.14 v59.69,6.99 | D6.C v67.94,4.45 | v53.34,25.4 R16.2 C22.2 | U$15.8-BS1 39.33,17.82 v38.73,18.41 | SD1.GND 6.4,6.48 v6.4,6.5
  Bottom 0.406: U2.2 v10.48,30 | R12.1 v4.45,36.2 | R20.2 v46.99,27.94
  Bottom 0.813: J1.1 12.59,34.56 v12.54,34.61
  other vias: 51.44,17.78 51.44,3.81
  pour Top (rank 6): 0,0 113.03,0 113.67,21.29 106.05,21.29 106.05,64.14 0,64.77
  pour Bottom (rank 3): 0,55.24 5.71,55.24 8.26,52.7 8.26,41.27 6.99,40.01 0,40.01
  pour Bottom: 48.9,19.05 48.9,19.68 49.53,20.32 51.44,20.32 52.07,19.68 52.07,13.34 51.44,12.7 49.53,12.7 48.9,13.34
  pour Bottom: 48.9,8.89 48.9,9.53 49.53,10.16 51.44,10.16 52.07,9.53 52.07,3.81 51.44,3.17 49.53,3.17 48.9,3.81
GPIO0  (via drill 0.3)
  Top 0.406: v83.34,57.47 v83.5,39.05 | v86.36,36.2 88.11,36.2 | 88.11,36.2 X2.25 | 88.11,36.2 88.11,34.1 R10.1
  Bottom 0.406: Q2.3 85.24,58.74 84.61,58.74 v83.34,57.47 | v83.5,39.05 v86.36,36.2
HSPI_CS0-IO15_A8  (via drill 0.3)
  Top 0.305: v17.78,20.32 24.55,27.09 JP2.10
  Top 0.406: X2.23 86.78,40.32 v88.11,40.32
  Bottom 0.305: SD1.CS 8.76,10.9 9.9,10.9 17.78,18.78 v17.78,20.32
  Bottom 0.406: JP2.10 24.45,57.31 39.21,42.55 81.28,42.55 81.92,41.91 84.14,41.91 85.72,40.32 v88.11,40.32
HSPI_MISO-IO12_A11  (via drill 0.3)
  Top 0.305: JP2.28 70.28,34.08 v69.53,33.34
  Top 0.406: X2.14 88.19,54.53 v88.27,54.61
  Bottom 0.305: v69.53,33.34 32.07,33.34 20.32,21.59 20.32,18.32 13,11 13,8 10.4,5.4 8.76,5.4 SD1.MISO
  Bottom 0.406: v88.27,54.61 87.63,53.98 73.66,53.98 73.66,54.03 JP2.28
HSPI_MOSI-IO13_A12  (via drill 0.3)
  Top 0.305: v50.16,34.77 50.16,57.21 JP2.20
  Top 0.406: X2.16 85.71,49.2 v85.09,48.58
  Bottom 0.305: v50.16,34.77 30.96,34.77 19.05,22.86 19.05,19 9.85,9.8 8.76,9.8 SD1.MOSI
  Bottom 0.406: v85.09,48.58 84.77,48.9 58.48,48.9 JP2.20
HSPI_SCLK-IO14_A6  (via drill 0.3)
  Top 0.305: v67.94,34.29 67.94,57.21 JP2.27
  Top 0.406: X2.13 89.45,54.53 v89.53,54.61
  Bottom 0.305: 19.7,22.24 31.43,33.97 67.63,33.97 v67.94,34.29 | 19.7,22.24 19.68,22.23 | SD1.SCK 8.76,7.6 10.6,7.6 12,9 12,11 19.7,18.7 19.7,22.24
  Bottom 0.406: v89.53,54.61 88.27,53.34 71.81,53.34 JP2.27
MISO  (via drill 0.3)
  Top 0.406: X2.31 95.89,36.35 v95.89,37.62
  Bottom 0.406: JP2.14 47.05,45.09 82.55,45.09 83.19,44.45 85.41,44.45 86.2,43.66 89.85,43.66 v95.89,37.62
N$1  (via drill 0.3)
  Top 0.305: v10.16,43.02 11.27,41.91 CHG.C
  Bottom 0.305: 10.19,41.72 10.16,41.75 10.22,41.75 R2.1 10.16,41.81 v10.16,43.02
N$2
  Bottom 0.406: U3.5 3.29,41.65 R8.1
N$3
  Bottom 0.305: U3.1 8.48,41.65 R2.2
N$4
  Bottom 0.305: R7.1 6.35,26.93 6.35,21.75 5.71,21.11 3.98,21.11 S1.3
N$5
  Top 0.406: R10.2 D3.C
N$6
  Top 0.305: C5.2 8.89,44.77 10.16,46.04 10.16,47.67 IC1.6
N$7
  pour Bottom: 2.54,35.56 6.83,35.56 10,32.38 10,30.8 9.68,30.48 2.7,30.48 2.06,31.11 2.06,35.08
N$8  (via drill 0.3)
  Top 0.305: v17.94,44.61 19.05,45.72 D5.A
  Bottom 0.305: v17.94,44.61 19.04,44.61 R1.2
N$9  (via drill 0.3)
  Top 0.305: SJ1.1 8.92,36.8 v6.99,38.73
  Bottom 0.305: 6.67,39.47 6.67,39.05 v6.99,38.73
  Bottom 0.406: 6.67,39.47 U3.3
N$10  (via drill 0.3)
  Top 0.305: v17.62,45.56 17.07,46.11 D2.A
  Bottom 0.305: 16.48,44.48 16.54,44.48 v17.62,45.56
  Bottom 0.406: R15.2 16.48,44.48
N$11
  Bottom 0.305: D6.A D1.C 59.27,4.45 C12.1
N$12  (via drill 0.3)
  Top 0.406: Q1.1 93.3,58.15 v93.03,58.42
  Bottom 0.406: v93.03,58.42 93.03,56.2 92.39,55.56 79.38,55.56 78.42,56.52 78.42,57.47 79.38,58.42 81.81,58.42 R9.2
N$13
  Bottom 0.406: R3.2 86.51,56.62 Q2.1
N$14  (via drill 0.3)
  Top 0.305: v46.35,22.86 46.35,20.32 v53.98,12.7
  Bottom 0.305: Q4.3 v46.35,22.86 | v53.98,12.7 54.13,12.7 L1.1 55.4,11.28 58.42,8.26 61.38,8.26 C12.2
  Bottom 0.813: L1.1 D7.A
  pour Bottom: 57.15,11.43 57.15,13.34 56.52,13.97 53.34,13.97 51.44,12.06 51.44,10.79 53.98,8.26 59.69,8.26 60.33,7.62 62.23,7.62 62.87,8.26 62.87,8.89 62.23,9.53 57.78,9.53 57.15,10.16
N$15
  Top 0.305: SJ4.3 101,13.84 R17.1
N$16
  Bottom 0.305: U$15.18-VDD 43.29,12.81 46.99,16.51 C15.1
N$17
  Bottom 0.305: C16.1 45.88,14.13 43.55,11.8 U$15.20-VSH
N$18
  Bottom 0.305: C17.1 45.72,8.89 43.81,10.79 40.95,10.79 U$15.22-VSL
N$19
  Bottom 0.305: U$15.24-VCOM 42.25,9.82 47.15,4.92 C18.1
N$20
  Bottom 0.305: U$15.5-VGH 48.41,19.32 C14.1
N$21
  pour Top: 13.02,51.75 13.02,51.99 14.13,53.1 18.18,53.1 19.53,51.75 19.53,51.44 19.13,51.04 13.73,51.04
N$22
  pour Top: 98.58,35.64 101.84,35.64 101.84,33.1 98.74,33.1 98.74,35.48
N$23
  Top 0.305: IC1.16 19.84,49.37 C19.1
N$24
  Bottom 0.305: U$15.4-VGL 43.93,19.8 44.45,20.32 54.19,20.32 C22.1
N$25
  pour Bottom (rank 6): 100.25,35.48 104.62,35.48 104.62,35.32 104.7,35.32 104.7,32.38 104.54,32.38 101.6,29.45 101.6,33.66 100.25,35
N$26
  pour Bottom (rank 6): 41.83,18.97 48.1,18.97 48.58,18.49 48.58,13.18 49.37,12.38 49.37,10.56 48.58,9.76 48.58,5.79 48.02,5.24 47.39,5.24 42.39,10.24 42.39,10.72 41.91,11.19 41.83,11.27
N$28
  pour Bottom (rank 6): 18.41,56.28 20,56.28 35.24,41.04 33.34,39.13 32.38,39.13 21.11,50.4 20.32,50.4 19.13,50.4 18.41,51.12 18.34,51.12 18.34,56.2 arc-90
N$44
  pour Bottom (rank 6): 104.14,45.72 87.63,45.72 87.63,37.15 104.78,37.15 104.78,45.72
RESET  (via drill 0.3)
  Top 0.406: SW2.B' 102.16,54.38 X2.3 | Q1.3 87.8,56.05 86.52,54.77 v86.36,54.77
  Bottom 0.406: v86.36,54.77 86.2,54.61 75.62,54.61 JP2.29
  pour Top: 91.12,54.61 103.5,54.61 104.96,55.56 105.46,56.52 105.44,57.83 99.67,57.83 99,57 91.12,56.83 90.81,56.52 90.81,54.93
RTS  (via drill 0.3)
  Top 0.305: IC1.19 16.19,51.12 18.73,51.12 v19.05,51.44
  Top 0.406: Q1.2 90.76,58.15 v90.49,58.42 | v87.31,58.42 83.19,58.42 81.92,57.15 v81.92,39.37
  Bottom 0.406: v90.49,58.42 88.69,58.42 R3.1 87.42,58.32 v87.31,58.42 | v81.92,39.37 78.74,39.37 78.11,40.01 34.29,40.01 22.86,51.44 v19.05,51.44
RXD0  (via drill 0.3)
  Top 0.254: 23.26,59.61 23.26,51.2 v22.23,50.16
  Top 0.305: v22.23,50.16 22.23,50.8 19.05,53.98 13.34,53.98 12.21,52.85 IC1.21
  Top 0.406: 99.69,36.27 X2.34 99.61,35.17 v99.74,35.05
  Bottom 0.406: v22.23,50.16 33.02,39.37 77.7,39.37 78.58,38.49 82.94,38.49 86.39,35.05 v99.74,35.05
RXLED
  Top 0.305: IC1.13 D2.C
  Top 0.406: D2.C
SCL  (via drill 0.3)
  Top 0.305: U4.P$4 103.87,16.91 103.66,16.91 103.19,17.38 103.19,20.08 v102.87,20.4 | 105.62,15.16 105.62,9.36 U1.1 103.33,7.07 R19.1 | X2.36 102.16,35.53
  Top 0.406: U4.P$4 105.62,15.16 R13.1 | 102.16,35.53 102.16,34.42 v101.28,33.54 | X2.36 102.23,36.35 v102.23,37.62
  Bottom 0.305: v101.28,33.54 101.28,21.99 v102.87,20.4
  Bottom 0.406: JP2.16 50.86,46.35 83.19,46.35 83.82,45.72 86.04,45.72 86.84,44.93 94.93,44.93 v102.23,37.62
SDA  (via drill 0.3)
  Top 0.305: 107.58,17.54 107.58,17.43 107.69,17.43 R11.1 107,17.23 v106.05,16.27 104.78,17.54 U4.P$3 | U1.6 104.94,7.23 v106.05,8.34 106.36,8.34 R18.1 | v98.42,33.52 98.42,36.19 X2.33
  Top 0.406: X2.33 98.42,36.35 v98.42,37.62
  Bottom 0.305: v98.42,33.52 98.42,20.08 101.28,17.23 105.09,17.23 v106.05,16.27 v106.05,8.34
  Bottom 0.406: JP2.15 48.95,45.72 82.87,45.72 83.5,45.09 85.72,45.09 86.52,44.29 91.76,44.29 v98.42,37.62
  pour Top: 104.14,7.7 104.78,7.7 106.68,9.61 107.31,9.61 108.58,8.34 108.58,6.43 107.95,5.79 107.31,5.79 106.68,6.43 104.78,6.43 104.14,7.07
  pour Bottom: 102.87,17.86 108.58,17.86 109.22,17.23 109.22,16.59 108.58,15.96 107.95,15.96 106.68,14.69 104.78,14.69 102.87,16.59
SDO/ADR
  Top 0.406: U4.P$5 101.84,13.8 SJ4.2
TXD0  (via drill 0.3)
  Top 0.305: v20.95,50.16 20.95,50.8 18.73,53.02 13.65,53.02 12.71,52.09 IC1.20
  Top 0.406: X2.35 100.93,36.32 100.93,34.52 v100.83,34.41
  Bottom 0.254: v20.95,50.16 19.05,50.16 18.18,51.04 18.18,59.45
  Bottom 0.406: v20.95,50.16 32.31,38.8 77.34,38.8 78.27,37.87 82.31,37.87 85.9,34.29 100.7,34.29 v100.83,34.41
TXLED
  Top 0.305: IC1.14 15.35,48.37 15.88,48.9 18.41,48.9 19.05,48.26 D5.C
USBD_N  (via drill 0.3)
  Top 0.305: IC1.4 7.39,48.87 v7.04,48.51
  Bottom 0.305: X4.2 6.93,48.4 v7.04,48.51
USBD_P  (via drill 0.3)
  Top 0.305: IC1.3 6.53,49.37 v6.36,49.2
  Bottom 0.305: X4.3 6.22,49.05 v6.36,49.2
VBAT  (via drill 0.3)
  Top 0.406: SJ1.2 10.45,39.24 C3.1 | 11.87,36.32 v11.91,36.35 | v97.32,32.73 103.32,32.73 103.82,32.23 103.82,31.41 R5.2
  Top 0.61: SJ1.2 11.87,36.32
  Bottom 0.406: J1.2 16.89,37.47 24.77,37.47 25.4,38.1 76.83,38.1 78.11,36.83 81.92,36.83 86.02,32.73 v97.32,32.73
  Bottom 0.61: Q3.3 11,35.45 v11.91,36.35 13.97,38.42 13.97,55.3 JP2.5
  pour Bottom: 11.43,35.56 18.26,35.56 19.05,36.35 19.05,37.31 18.57,37.78 11.27,37.78 10.79,37.31 10.79,36.04 10.95,36.04
VBUS  (via drill 0.3)
  Top 0.305: v11.27,45.4 CHG.A | IC1.7 IC1.8 11.21,45.46 v11.27,45.4 | C21.1 C20.1 14.76,41.91 v11.27,45.4
  Bottom 0.406: U3.4 3.78,39.72 v2.38,38.42 | JP2.3 6.78,56.09 9.21,53.66 9.21,47.94 8.26,46.99 | Q3.1 9.1,33.45 7.3,35.24 7.3,37.47
  pour Bottom: 4.45,40.64 3.33,40.64 1.75,40.32 1.75,37.15 3.02,36.51 4.76,36.51 5.08,36.83 8.89,36.83 11.43,39.37 11.27,46.04 8.41,46.04 8.41,46.67 9.05,47.31 9.05,47.94 4.45,47.94 4.29,47.78 4.29,47.15 4.45,46.99 5.56,46.99 8.73,43.81 8.73,40.32 7.14,38.73 6.35,38.73

### Text on the board
tPlace: Reset | > | 3.3V | GND | VBUS | GND | VBAT | GND | EN | EBSY / IO4 | ERST / IO16 | HCS / IO15 | EDC / IO17 | ECS / SCK / IO5 | ECLK / MOSI / IO18 | MISO / IO19 | SDA / IO21 | SCL / IO22 | EMOSI / IO23 | IO36 | IO39 | HMOSI / IO13 | BTN / IO34 | BTN / IO32 | BTN / IO33 | A1 / DAC1 / IO25 | A0 / DAC2 / IO26 | BTN / IO27 | HSCLK / IO14 | HMISO / IO12 | RESET | RX LED | TX LED | IO33 | Off | On | . | IO2 | IO32 | IO34 | BME680 / Temp/Humidity/Pressure | IO27 | TSL2591 / HDR Light Sensor IR/Full Spectrum | Sensornode V1.2 | John 'Warthog9' Hawley | (C) 2018 CC-BY-SA 4.0 | https://github.com/unreproducible/sensornode
bPlace: Sensornode V1.2 | John 'Warthog9' Hawley | (C) 2018 CC-BY-SA 4.0 | https://github.com/unreproducible/sensornode
bNames: Disable Serial 3.3V